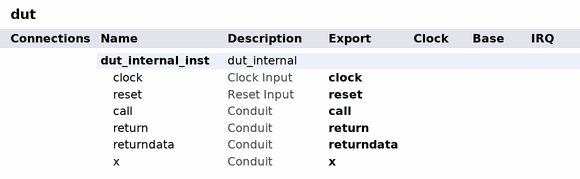
[diagram p0: system contents]
# Platform Designer (Qsys) system dut, Cyclone V 5CGXFC7C7F23C8
# Parameters at their usual value, and those the tool derives, are not listed.
package require qsys
create_system dut
set_project_property DEVICE_FAMILY {Cyclone V}
set_project_property DEVICE 5CGXFC7C7F23C8

add_instance dut_internal_inst dut_internal 1.0
set_instance_property dut_internal_inst AUTO_EXPORT true

# exported interfaces
add_interface call conduit end
set_interface_property call EXPORT_OF dut_internal_inst.call
add_interface clock clock sink
set_interface_property clock EXPORT_OF dut_internal_inst.clock
add_interface reset reset sink
set_interface_property reset EXPORT_OF dut_internal_inst.reset
add_interface return conduit end
set_interface_property return EXPORT_OF dut_internal_inst.return
add_interface returndata conduit end
set_interface_property returndata EXPORT_OF dut_internal_inst.returndata
add_interface x conduit end
set_interface_property x EXPORT_OF dut_internal_inst.x

set_interconnect_requirement {$system} qsys_mm.clockCrossingAdapter HANDSHAKE
set_interconnect_requirement {$system} qsys_mm.enableEccProtection FALSE
set_interconnect_requirement {$system} qsys_mm.insertDefaultSlave FALSE
set_interconnect_requirement {$system} qsys_mm.maxAdditionalLatency 1

save_system dut.qsys
